# EAGLE design i2c_stm32 (EAGLE 9.4.0)

## Sheet 1 of 3: STM32F103C8 - Microcontroller
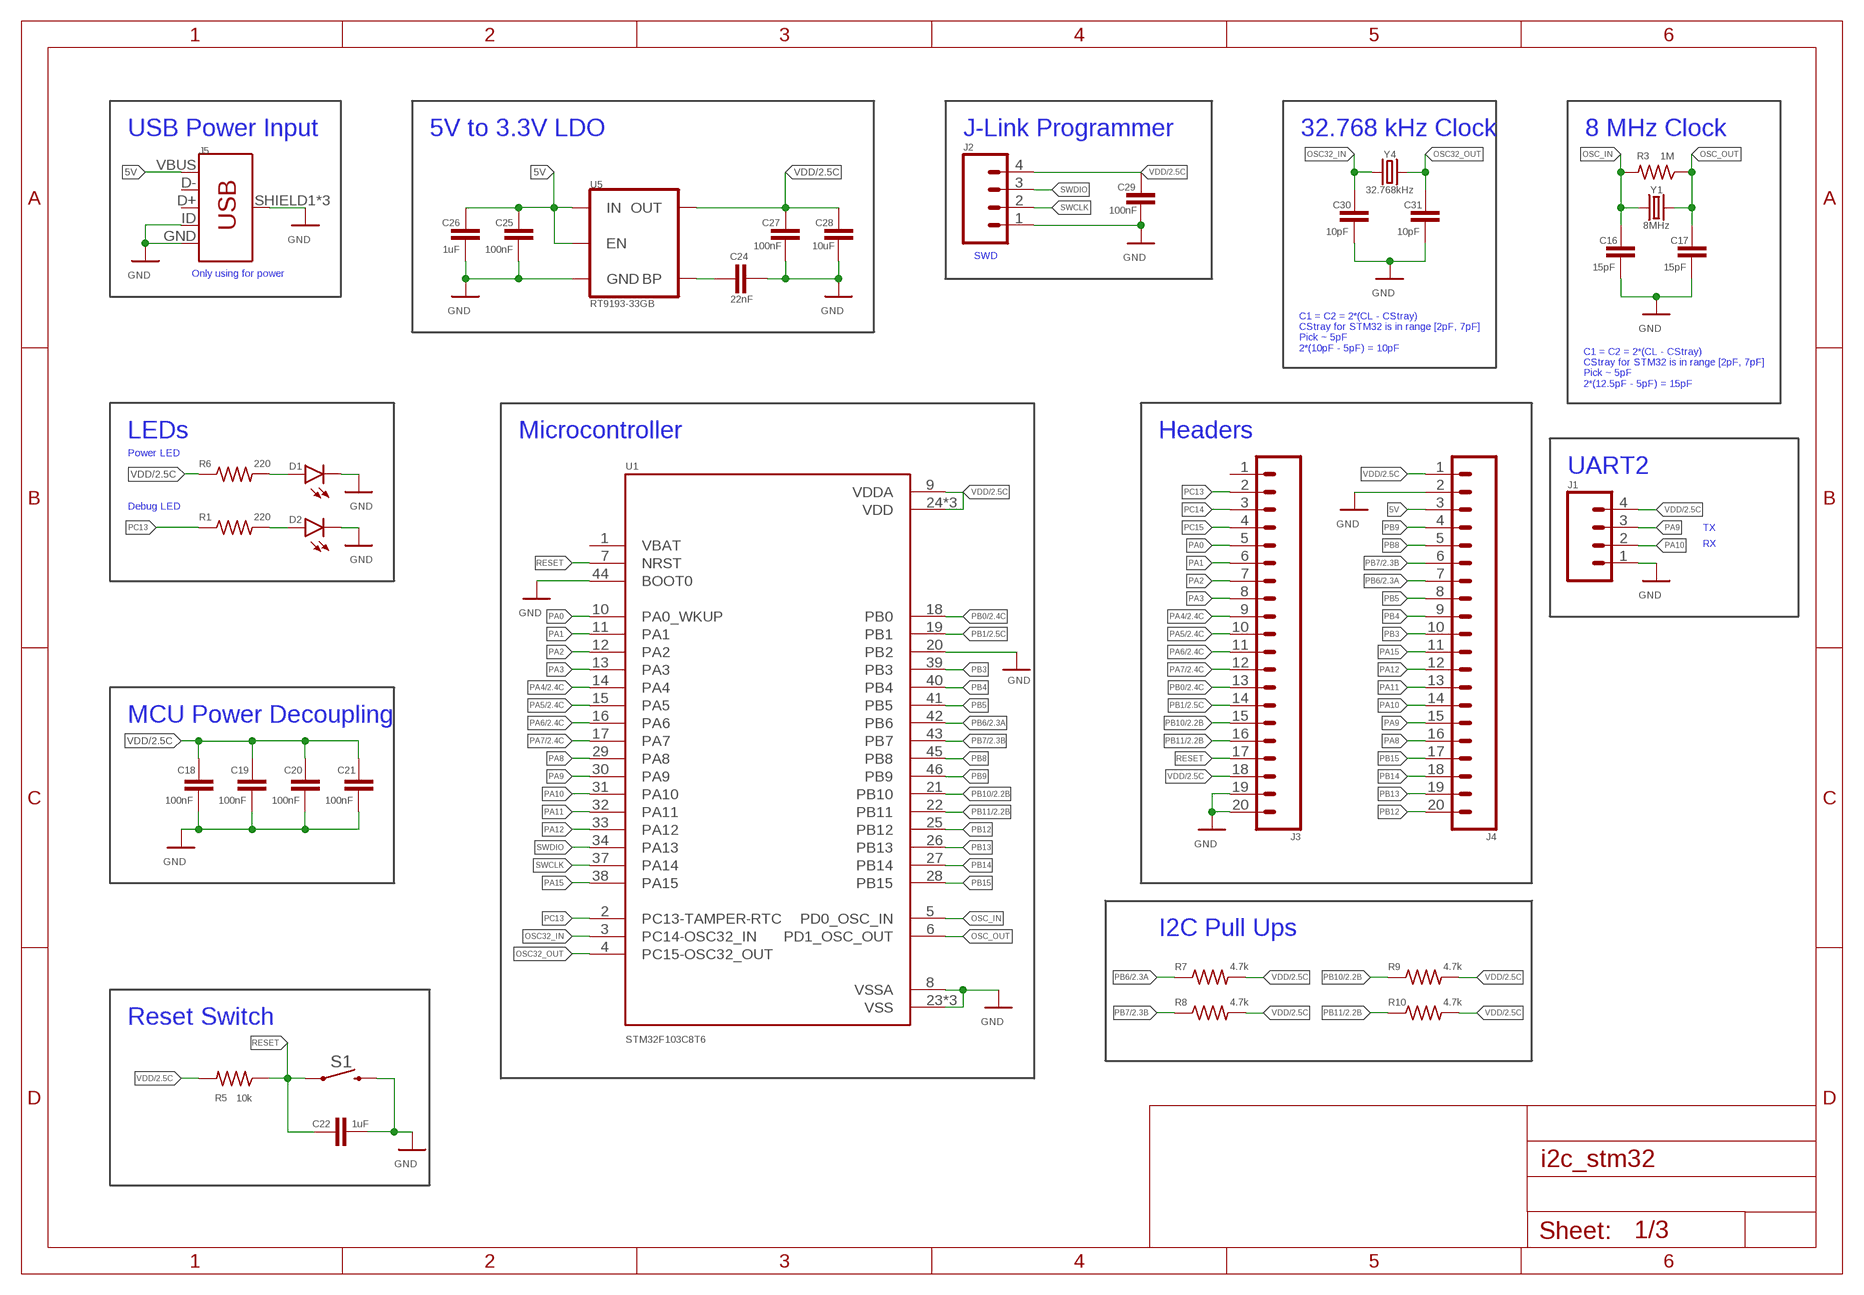
[diagram p0: schematic, sheet 1]

### Parts
C16  15pF  C0603C100C5GACTU  [CAP_0603]
C17  15pF  C0603C100C5GACTU  [CAP_0603]
C18  100nF  C0603C100C5GACTU  [CAP_0603]
C19  100nF  C0603C100C5GACTU  [CAP_0603]
C20  100nF  C0603C100C5GACTU  [CAP_0603]
C21  100nF  C0603C100C5GACTU  [CAP_0603]
C22  1uF  C0603C100C5GACTU  [CAP_0603]
C24  22nF  C0603C100C5GACTU  [CAP_0603]
C25  100nF  C0603C100C5GACTU  [CAP_0603]
C26  1uF  C0603C100C5GACTU  [CAP_0603]
C27  100nF  C0603C100C5GACTU  [CAP_0603]
C28  10uF  C0603C100C5GACTU  [CAP_0603]
C29  100nF  C0603C100C5GACTU  [CAP_0603]
C30  10pF  C0603C100C5GACTU  [CAP_0603]
C31  10pF  C0603C100C5GACTU  [CAP_0603]
D1  LED0603  [LED-0603]
D2  LED0603  [LED-0603]
J1  CONN_04  [1X04]
J2  CONN_04  [1X04]
J3  CONN_20  [1X20]
J4  CONN_20  [1X20]
J5  USB_MICRO-B_FEMALE-SMT  [USB-B-MICRO-SMD]
R1  220  RC0603JR-070RL  [RES_0603]
R3  1M  RC0603JR-070RL  [RES_0603]
R5  10k  RC0603JR-070RL  [RES_0603]
R6  220  RC0603JR-070RL  [RES_0603]
R7  4.7k  RC0603JR-070RL  [RES_0603]
R8  4.7k  RC0603JR-070RL  [RES_0603]
R9  4.7k  RC0603JR-070RL  [RES_0603]
R10  4.7k  RC0603JR-070RL  [RES_0603]
S1  MOMENTARY-SWITCH-SPST-PTH-6.0MM  [TACTILE_SWITCH_PTH_6.0MM]
U1  STM32F103C8T6  [QFP50P900X900X160-48N]
U5  RT9193-33GB  V_REG_MIC5205ADJ  [SOT23-5]
Y1  8MHz  CRYSTAL-8MHZSMD-5X3.2  [CRYSTAL-SMD-5X3.2-4PAD]
Y4  32.768kHz  CRYSTAL-32.768KHZSMD-3.2X1.5  [CRYSTAL-SMD-3.2X1.5MM]

### Nets
5V: C25.2 C26.2 J4.3 J5.VBUS U5.1(IN) U5.3(EN)
GND: C16.2 C17.2 C18.2 C19.2 C20.2 C21.2 C22.2 C24.1 C25.1 C26.1 C27.2 C28.2 C29.2 C30.2 C31.2 D1.C D2.C J1.1 J2.1 J3.19 J3.20 J4.2 J5.GND J5.ID J5.SHIELD1(SHIELD) J5.SHIELD2(SHIELD) J5.SHIELD3(SHIELD) S1.3 U1.8(VSSA) U1.20(PB2) U1.23(VSS) U1.35(VSS) U1.44(BOOT0) U1.47(VSS) U5.2(GND) ; also sheet 2
N$4: D1.A R6.2
N$5: C24.2 U5.4(BP)
N$6: D2.A R1.2
OSC32_IN: C30.1 U1.3(PC14-OSC32_IN) Y4.P$1
OSC32_OUT: C31.1 U1.4(PC15-OSC32_OUT) Y4.P$2
OSC_IN: C16.1 R3.2 U1.5(PD0_OSC_IN) Y1.1
OSC_OUT: C17.1 R3.1 U1.6(PD1_OSC_OUT) Y1.3
PA0: J3.5 U1.10(PA0_WKUP)
PA1: J3.6 U1.11(PA1)
PA2: J3.7 U1.12(PA2)
PA3: J3.8 U1.13(PA3)
PA4: J3.9 U1.14(PA4) ; also sheet 2
PA5: J3.10 U1.15(PA5) ; also sheet 2
PA6: J3.11 U1.16(PA6) ; also sheet 2
PA7: J3.12 U1.17(PA7) ; also sheet 2
PA8: J4.16 U1.29(PA8)
PA9: J1.3 J4.15 U1.30(PA9)
PA10: J1.2 J4.14 U1.31(PA10)
PA11: J4.13 U1.32(PA11)
PA12: J4.12 U1.33(PA12)
PA15: J4.11 U1.38(PA15)
PB0: J3.13 U1.18(PB0) ; also sheet 2
PB1: J3.14 U1.19(PB1) ; also sheet 2
PB3: J4.10 U1.39(PB3)
PB4: J4.9 U1.40(PB4)
PB5: J4.8 U1.41(PB5)
PB6: J4.7 R7.1 U1.42(PB6) ; also sheet 2
PB7: J4.6 R8.1 U1.43(PB7) ; also sheet 2
PB8: J4.5 U1.45(PB8)
PB9: J4.4 U1.46(PB9)
PB10: J3.15 R9.1 U1.21(PB10) ; also sheet 2
PB11: J3.16 R10.1 U1.22(PB11) ; also sheet 2
PB12: J4.20 U1.25(PB12)
PB13: J4.19 U1.26(PB13)
PB14: J4.18 U1.27(PB14)
PB15: J4.17 U1.28(PB15)
PC13: J3.2 R1.1 U1.2(PC13-TAMPER-RTC)
PC14: J3.3
PC15: J3.4
RESET: C22.1 J3.17 R5.1 S1.1 U1.7(NRST)
SWCLK: J2.2 U1.37(PA14)
SWDIO: J2.3 U1.34(PA13)
VDD: C18.1 C19.1 C20.1 C21.1 C27.1 C28.1 C29.1 J1.4 J2.4 J3.18 J4.1 R5.2 R6.1 R7.2 R8.2 R9.2 R10.2 U1.9(VDDA) U1.24(VDD) U1.36(VDD) U1.48(VDD) U5.5(OUT) ; also sheet 2
Unconnected: J3.1 J5.D+ J5.D- U1.1(VBAT)

### Notes on the sheet
- USB Power Input | 5V to 3.3V LDO | J-Link Programmer | 32.768 kHz Clock | 8 MHz Clock
- SWD
- Only using for power
- C1 = C2 = 2*(CL - CStray)
  CStray for STM32 is in range [2pF, 7pF]
  Pick ~ 5pF
  2*(10pF - 5pF) = 10pF
- C1 = C2 = 2*(CL - CStray)
  CStray for STM32 is in range [2pF, 7pF]
  Pick ~ 5pF
  2*(12.5pF - 5pF) = 15pF
- LEDs | Microcontroller | Headers
- Power LED
- UART2
- Debug LED
- TX
- RX
- MCU Power Decoupling
- I2C Pull Ups
- Reset Switch

## Sheet 2 of 3: BMP280 - Barometer
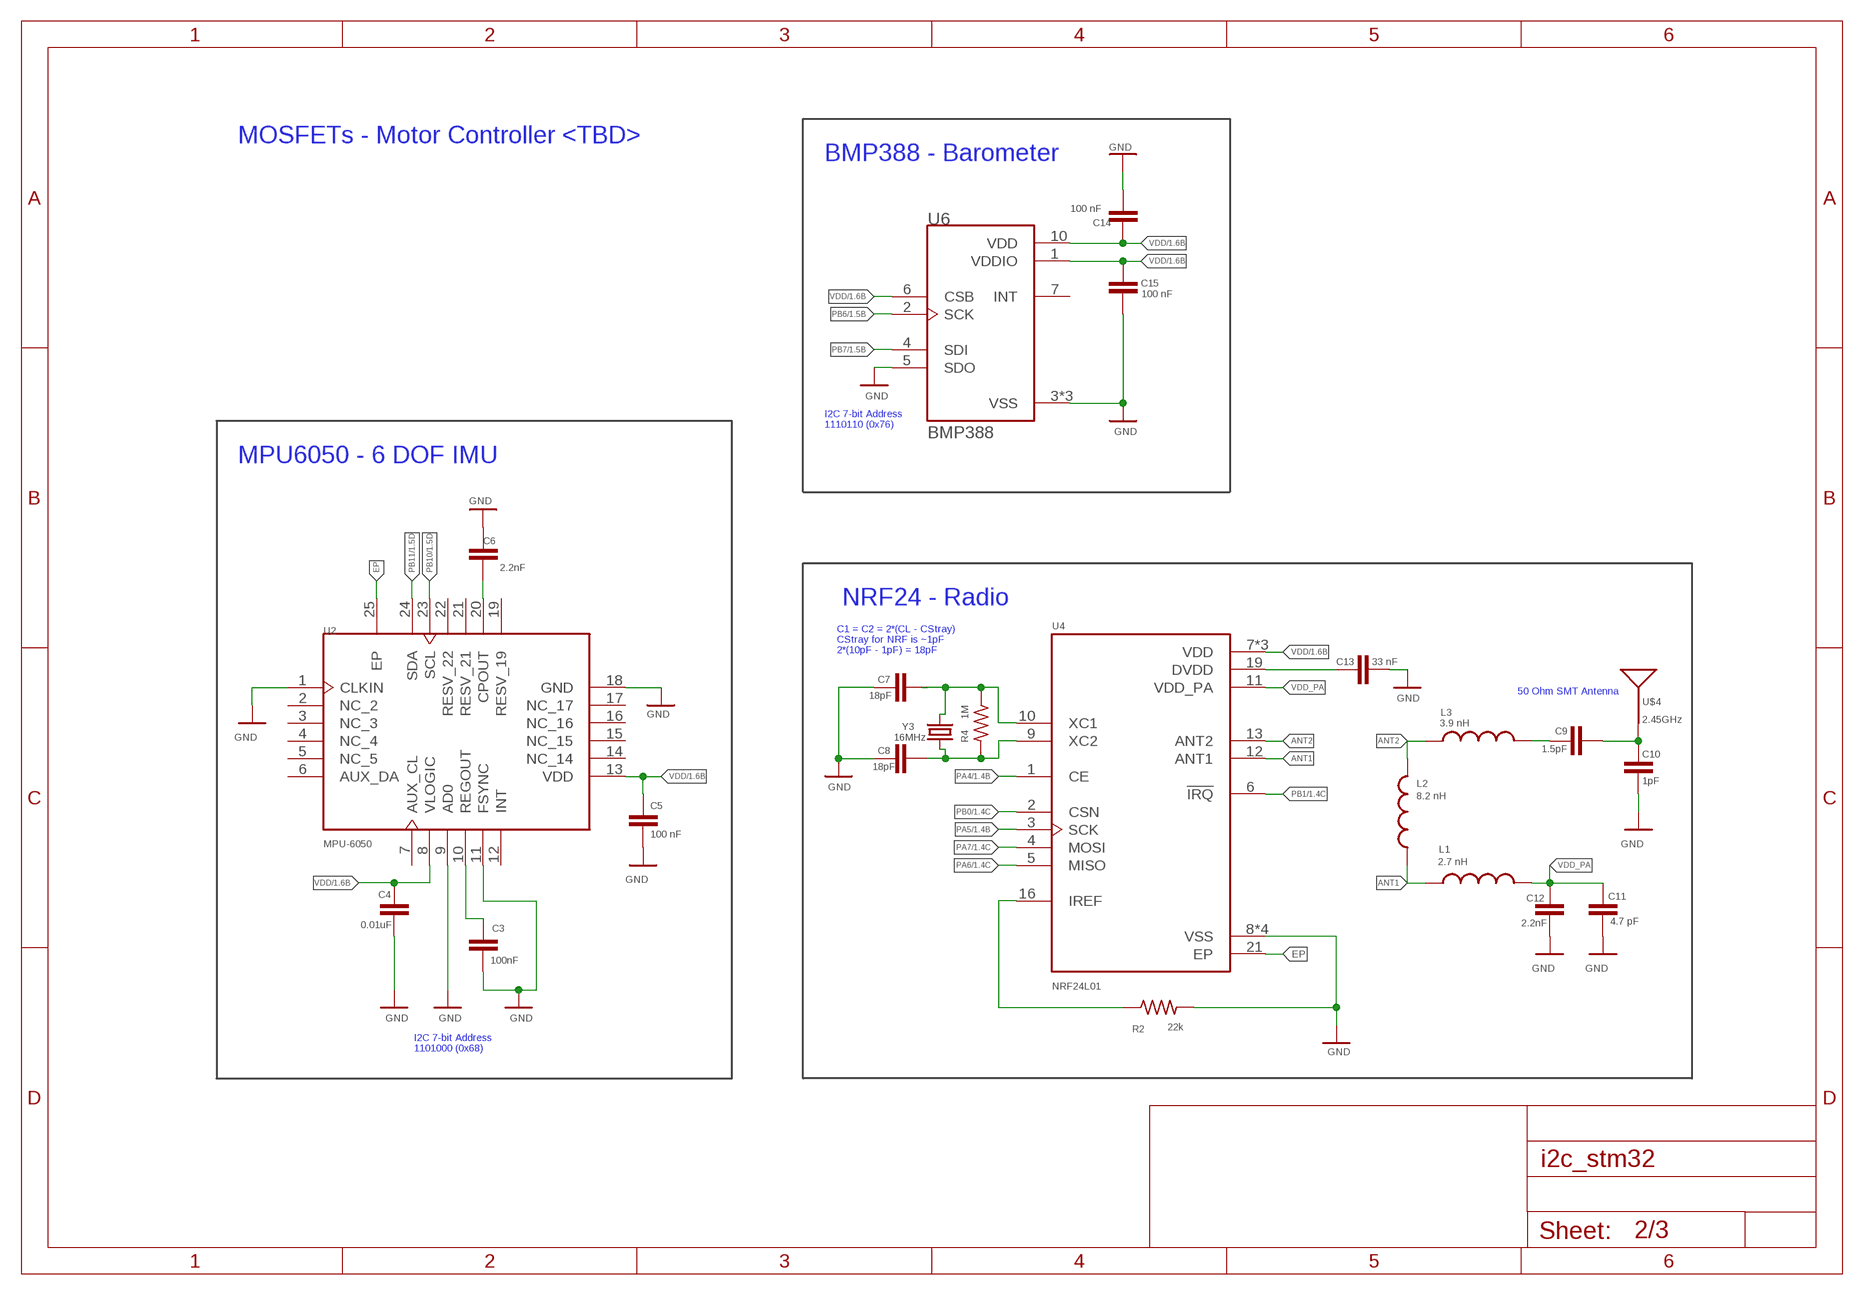
[diagram p1: schematic, sheet 2]

### Parts
C3  100nF  C0603C100C5GACTU  [CAP_0603]
C4  0.01uF  C0603C100C5GACTU  [CAP_0603]
C5  100 nF  C0603C100C5GACTU  [CAP_0603]
C6  2.2nF  C0603C100C5GACTU  [CAP_0603]
C7  18pF  C0603C100C5GACTU  [CAP_0603]
C8  18pF  C0603C100C5GACTU  [CAP_0603]
C9  1.5pF  C0603C100C5GACTU  [CAP_0603]
C10  1pF  C0603C100C5GACTU  [CAP_0603]
C11  4.7 pF  C0603C100C5GACTU  [CAP_0603]
C12  2.2nF  C0603C100C5GACTU  [CAP_0603]
C13  33 nF  C0603C100C5GACTU  [CAP_0603]
C14  100 nF  C0603C100C5GACTU  [CAP_0603]
C15  100 nF  C0603C100C5GACTU  [CAP_0603]
L1  2.7 nH  INDUCTOR_0603_M  [RESC0603_M]
L2  8.2 nH  INDUCTOR_0603_M  [RESC0603_M]
L3  3.9 nH  INDUCTOR_0603_M  [RESC0603_M]
R2  22k  RC0603JR-070RL  [RES_0603]
R4  1M  RC0603JR-070RL  [RES_0603]
U2  MPU-6050  [24-VFQFN]
U4  NRF24L01  [QFN50P400X400X95-21N]
U6  BMP388  [PQFN50P200X200X80-10N]
U$4  2.45GHz  ANTENNA2.4GHZ-6.5X2.2MM  [ANT-2.4GHZ-6.5X2.2MM]
Y3  16MHz  CRYSTAL-16MHZSMD-5X3.2  [CRYSTAL-SMD-5X3.2-4PAD]

### Nets
ANT1: L1.1 L2.1 U4.12(ANT1)
ANT2: L2.2 L3.1 U4.13(ANT2)
EP: U2.25(EP) U4.21(EP)
GND: C3.2 C4.2 C5.2 C6.2 C7.2 C8.2 C10.1 C11.1 C12.1 C13.2 C14.2 C15.1 R2.2 U2.1(CLKIN) U2.9(AD0) U2.11(FSYNC) U2.18(GND) U4.8(VSS) U4.14(VSS) U4.17(VSS) U4.20(VSS) U6.3(VSS) U6.5(SDO) U6.8(VSS) U6.9(VSS) ; also sheet 1
N$2: C3.1 U2.10(REGOUT)
N$3: C6.1 U2.20(CPOUT)
N$7: C8.1 R4.2 U4.9(XC2) Y3.1
N$8: C7.1 R4.1 U4.10(XC1) Y3.3
N$9: R2.1 U4.16(IREF)
N$12: C9.2 C10.2 U$4.FEED(SIGNAL)
N$13: C9.1 L3.2
N$17: C13.1 U4.19(DVDD)
PA4: U4.1(CE) ; also sheet 1
PA5: U4.3(SCK) ; also sheet 1
PA6: U4.5(MISO) ; also sheet 1
PA7: U4.4(MOSI) ; also sheet 1
PB0: U4.2(CSN) ; also sheet 1
PB1: U4.6(!IRQ) ; also sheet 1
PB6: U6.2(SCK) ; also sheet 1
PB7: U6.4(SDI) ; also sheet 1
PB10: U2.23(SCL) ; also sheet 1
PB11: U2.24(SDA) ; also sheet 1
VDD: C4.1 C5.1 C14.1 C15.2 U2.8(VLOGIC) U2.13(VDD) U4.7(VDD) U4.15(VDD) U4.18(VDD) U6.1(VDDIO) U6.6(CSB) U6.10(VDD) ; also sheet 1
VDD_PA: C11.2 C12.2 L1.2 U4.11(VDD_PA)
Unconnected: U2.2(NC_2) U2.3(NC_3) U2.4(NC_4) U2.5(NC_5) U2.6(AUX_DA) U2.7(AUX_CL) U2.12(INT) U2.14(NC_14) U2.15(NC_15) U2.16(NC_16) U2.17(NC_17) U2.19(RESV_19) U2.21(RESV_21) U2.22(RESV_22) U6.7(INT)

### Notes on the sheet
- MOSFETs - Motor Controller <TBD>
- BMP388 - Barometer
- I2C 7-bit Address
  1110110 (0x76)
- MPU6050 - 6 DOF IMU
- NRF24 - Radio
- C1 = C2 = 2*(CL - CStray)
  CStray for NRF is ~1pF
  2*(10pF - 1pF) = 18pF
- 50 Ohm SMT Antenna
- I2C 7-bit Address
  1101000 (0x68)

## Sheet 3 of 3
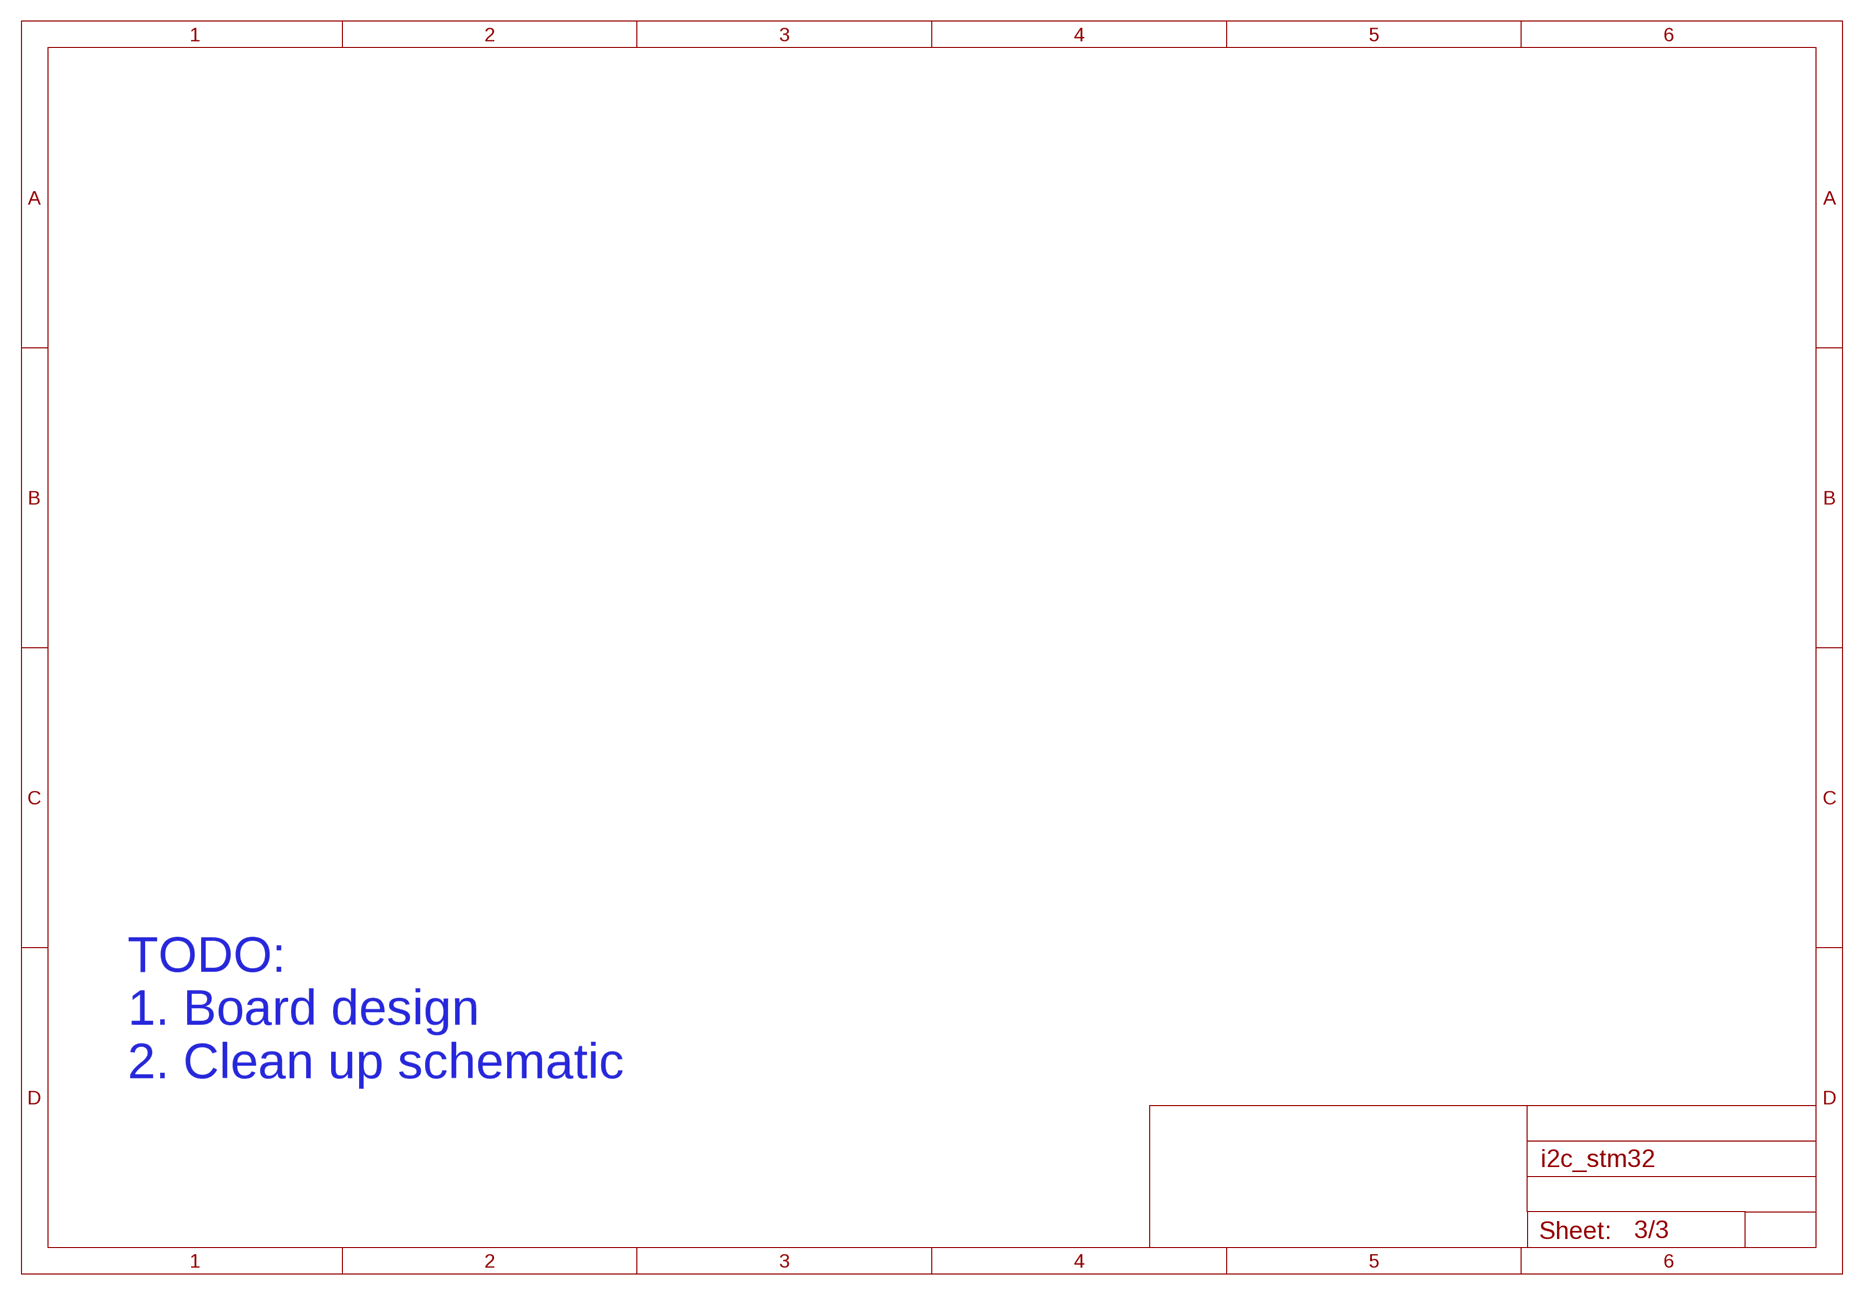
[diagram p2: schematic, sheet 3]

### Notes on the sheet
- TODO:
  1. Board design
  2. Clean up schematic

## Library data of the parts
C3-C22 C24-C31 = Resistor_Capacitor:C0603C100C5GACTU: CAP CER 10PF 50V C0G/NP0 0603 Manufacturer's datasheet <https://content.kemet.com/datasheets/KEM_C1003_C0G_SMD.pdf>; CREATED_BY: PCBLayout.com; DIGIKEY_PART_NUMBER: 399-7814-2-ND; MANUFACTURER: KEMET; MPN: C0603C100C5GACTU; PACKAGE: SMD 0603
D1 D2 = SparkFun-LED:LED: LED (Generic) Standard schematic elements and footprints for 5mm, 3mm, 1206, and 0603 sized LEDs. Generic LEDs with no color specified.
J1 J2 = SparkFun-Connectors:CONN_04: Multi connection point. Often used as Generic Header-pin footprint for 0.1 inch spaced/style header connections On any of the 0.1 inch spaced packages, you can populate with these: Break Away Headers - Straight <https://www.sparkfun.com/products/116> (PRT-00116) Break Away Male Headers - Right Angle <https://www.sparkfun.com/products/553> (PRT-00553) Female Headers <https://www.sparkfun.com/products/115> (PRT-00115) Break Away Headers - Machine Pin <https://www.sparkfun.com/products/117> (PRT-00117) Break Away Female Headers - Swiss Machine Pin <https://www.sparkfun.com/products/743> (PRT-00743) For SCREWTERMINALS and SPRING TERMINALS visit here: Screw Terimnals on SparkFun.com <https://www.sparkfun.com/search/results?term=Screw+Terminals> (5mm/3.5mm/2.54mm spacing) This device is also useful as a general connection point to wire up your design to another part of your project. Our various solder wires solder well into these plated through hole pads. Hook-Up Wire - Assortment (Stranded, 22 AWG) <https://www.sparkfun.com/products/11375> (PRT-11375) Hook-Up Wire - Assortment (Solid Core, 22 AWG) <https://www.sparkfun.com/products/11367> (PRT-11367) View the entire wire category on our website here <https://www.sparkfun.com/categories/141> Special notes: Molex polarized connector foot print use with SKU : PRT-08231 with associated crimp pins and housings. 1MM SMD Version SKU: PRT-10208; PROD_ID: CONN-09696
J3 J4 = SparkFun-Connectors:CONN_20: Multi connection point. Often used as Generic Header-pin footprint for 0.1 inch spaced/style header connections On any of the 0.1 inch spaced packages, you can populate with these: Break Away Headers - Straight <https://www.sparkfun.com/products/116> (PRT-00116) Break Away Male Headers - Right Angle <https://www.sparkfun.com/products/553> (PRT-00553) Female Headers <https://www.sparkfun.com/products/115> (PRT-00115) Break Away Headers - Machine Pin <https://www.sparkfun.com/products/117> (PRT-00117) Break Away Female Headers - Swiss Machine Pin <https://www.sparkfun.com/products/743> (PRT-00743) For SCREWTERMINALS and SPRING TERMINALS visit here: Screw Terimnals on SparkFun.com <https://www.sparkfun.com/search/results?term=Screw+Terminals> (5mm/3.5mm/2.54mm spacing) This device is also useful as a general connection point to wire up your design to another part of your project. Our various solder wires solder well into these plated through hole pads. Hook-Up Wire - Assortment (Stranded, 22 AWG) <https://www.sparkfun.com/products/11375> (PRT-11375) Hook-Up Wire - Assortment (Solid Core, 22 AWG) <https://www.sparkfun.com/products/11367> (PRT-11367) View the entire wire category on our website here <https://www.sparkfun.com/categories/141> Special notes: Molex polarized connector foot print use with SKU : PRT-08231 with associated crimp pins and housings. 1MM SMD Version SKU: PRT-10208 NOTES ON THE VARIANTS LOCK and LOCK_LONGPADS... This footprint was designed to help hold the alignment of a through-hole component (i.e. 6-pin header) while soldering it into place. You may notice that each hole has been shifted either up or down by 0.005 of an inch from it's more standard position (which is a perfectly straight line). This slight alteration caused the pins (the squares in the middle) to touch the edges of the holes. Because they are alternating, it causes a "brace" to hold the component in place. 0.005 has proven to be the perfect amount of "off-center" position when using our standard breakaway headers. Although looks a little odd when you look at the bare footprint, once you have a header in there, the alteration is very hard to notice. Also,if you push a header all the way into place, it is covered up entirely on the bottom side. Note about LOCK SPECIAL package: This is just like the LOCK variant in that the holes are staggared by 5 mil, but except for the last two holes. They are not altered from the "standard" footprint layout. This is used for a special purpose on the layout of our Graphic LCD Backpack. Make sure you want to use this device before selecting it for you project!
J5 = SparkFun-Connectors:USB_MICRO-B: USB Type Micro-B Connector Male/female and PTH/SMT variants SparkFun Products: SparkFun microB USB Breakout <https://www.sparkfun.com/products/12035> SparkFun USB microB Plug Breakout <https://www.sparkfun.com/products/10031> SparkFun ESP8266 Thing <https://www.sparkfun.com/products/13231>; PROD_ID: CONN-11752
L1-L3 = Nordic_nRF:INDUCTOR: Generic chip inductor
R1-R10 = Resistor_Capacitor:RC0603JR-070RL: RES SMD 0 OHM JUMPER 1/10W 0603 Manufacturer's datasheet <http://www.yageo.com/documents/recent/PYu-RC_Group_51_RoHS_L_10.pdf>; CREATED_BY: PCBLayout.com; DIGIKEY_PART_NUMBER: 311-0.0GRTR-ND; MANUFACTURER: Yageo; MPN: RC0603JR-070RL; PACKAGE: SMD 0603
S1 = SparkFun-Switches:MOMENTARY-SWITCH-SPST: Momentary Switch (Pushbutton) - SPST Normally-open (NO) SPST momentary switches (buttons, pushbuttons). Variants PTH-12MM - 12mm square, through-hole Momentary Pushbutton Switch - 12mm Square <https://www.sparkfun.com/products/9190> (COM-09190) PTH-6.0MM, PTH-6.0MM-KIT - 6.0mm square, through-hole Mini Pushbutton Switch <https://www.sparkfun.com/products/97> (COM-00097) KIT package intended for soldering kit's - only one side of pads' copper is exposed. PTH-RIGHT-ANGLE-KIT - Right-angle, through-hole Right Angle Tactile Button <https://www.sparkfun.com/products/10791> - Used on SparkFun BigTime Watch Kit <https://www.sparkfun.com/products/11734> SMD-12MM - 12mm square, surface-mount Tactile Button - SMD (12mm) <https://www.sparkfun.com/products/12993> (COM-12993) Used on SparkFun PicoBoard <https://www.sparkfun.com/products/11888> SMD-4.5MM - 4.5mm Square Trackball Switch Used on SparkFun Blackberry Trackballer Breakout <https://www.sparkfun.com/products/13169> SMD-4.6MMX2.8MM - 4.60mm x 2.80mm, surface mount Used on SparkFun SAMD21 Mini Breakout <https://www.sparkfun.com/products/13664> SMD-5.2MM, SMD-5.2-REDUNDANT - 5.2mm square, surface-mount Mini Pushbutton Switch - SMD <https://www.sparkfun.com/products/8720> (COM-08720) Used on Arduino Pro Mini <https://www.sparkfun.com/products/11114> REDUNDANT package connects both switch circuits together SMD-6.0X3.5MM - 6.0 x 3.5mm, surface mount Momentary Reset Switch SMD <https://www.sparkfun.com/products/8229> (COM-08229) SMD-6.2MM-TALL - 6.2mm square, surface mount Tactile Button - SMD (6mm) <https://www.sparkfun.com/products/12992> Used on SparkFun Digital Sandbox <https://www.sparkfun.com/products/12651> SMD-RIGHT-ANGLE - Right-angle, surface mount Used on SparkFun Block for Intel® Edison - Arduino <https://www.sparkfun.com/products/13036>; PROD_ID: SWCH-08441; SF_SKU: COM-00097
U1 = STM32F103C8T6:STM32F103C8T6: Mainstream Performance line, ARM Cortex-M3 MCU with 64 Kbytes Flash, 72 MHz CPU, motor control, USB and CAN Check prices <https://pricing.snapeda.com/parts/STM32F103C8T6/STMicroelectronics/view-part?ref=eda>; AVAILABILITY: Warning; DESCRIPTION: ARM® Cortex®-M3 STM32F1 Microcontroller IC 32-Bit 72MHz 64KB (64K x 8) FLASH 48-LQFP (7x7); MF: STMicroelectronics; MP: STM32F103C8T6; PACKAGE: LQFP-48 STMicroelectronics; PRICE: None; PURCHASE-URL: https://pricing.snapeda.com/search/part/STM32F103C8T6/?ref=eda; SPICEPREFIX: X
U2 = Sensor:MPU-6050: IMU ACCEL/GYRO 3-AXIS I2C 24QFN Manufacturer's datasheet <https://store.invensense.com/datasheets/invensense/MPU-6050_DataSheet_V3%204.pdf>; CREATED_BY: PCBLayout.com; DIGIKEY_PART_NUMBER: 1428-1007-1-ND; MANUFACTURER: TDK InvenSense; MPN: MPU-6050; PACKAGE: 24-VFQFN
U4 = NRF24L01:NRF24L01: The nRF24L01 is a single chip 2.4GHz transceiver with an embedded baseband protocol engine (Enhanced ShockBurst™), designed for ultra low power wireless applications. The nRF24L01 is designed for operation in the world wide ISM frequency band at 2.400 - 2.4835GHz. An MCU (microcontroller) and very few external passive components are needed to design a radio system with the nRF24L01. The nRF24L01 is configured and operated through a Serial Peripheral Interface (SPI.) Through this interface the register map is available. The register map contains all configuration registers in the nRF24L01 and is accessible in all operation modes of the chip. Check prices <https://pricing.snapeda.com/parts/NRF24L01/Nordic/view-part?ref=eda>; AVAILABILITY: Warning; DESCRIPTION: IC RF TxRx Only General ISM > 1GHZ 2.4GHz 20-VFQFN Exposed Pad; MF: Nordic; MP: NRF24L01; PACKAGE: VFQFN-20 Nordic Semiconductor; PRICE: None; PURCHASE-URL: https://pricing.snapeda.com/search/part/NRF24L01/?ref=eda
U5 = SparkFun-IC-Power:V_REG_MIC5205: V_REG MIC5205 Standard 3.3V, 5V, and Adjustable 150mA LDO voltage regulator in SOT-23 layout. Micrel part MIC5205. BP (by-pass) pin is used to lower output noise with 470pF cap, may be left open. On the adjustable version BP is used to set output.; PROD_ID: VREG-12594; VALUE: ADJ
U6 = BMP388:BMP388: P-Sensor SPI I2C 1, 25 Bar SMD; DESCRIPTION: Pressure Sensor 4.35PSI ~ 18.13PSI (30kPa ~ 125kPa) Absolute 10-WFLGA; DIGI-KEY_PART_NUMBER: 828-1079-1-ND; MF: Bosch Sensortec; MP: BMP388; PACKAGE: WFLGA-10 Bosch Tools; PURCHASE-URL: https://pricing.snapeda.com/search/part/BMP388/?ref=eda
U$4 = SparkFun-RF:ANTENNA: Single-ended Antennae 2.4GHz and antennae with just one terminal. These are all chip antennae. 2.4GHz (WiFi/BT/ZigBee) Antennae ANT-2.4GHZ-6.5X2.2MM - 6.5 x 2.2 mm chip antenna. (SparkFun Product <https://www.sparkfun.com/products/144>) ANT-2.4GHZ8.0X1.0MM - 8.0 x 1.0 mm chip antenna. (Datasheet <http://www.mouser.com/ds/2/611/antenna_2500at44m0400-242425.pdf>) ANT-2.4GHZ9.5X2.0MM - 9.5 x 2.0 mm chip antenna. (SparkFun Product <https://www.sparkfun.com/products/9025>); PROD_ID: ANT-08187; SF_ID: WRL-00144
Y1 = SparkFun-Clocks:CRYSTAL-8MHZ: 8MHz Crystal Datasheet Example <http://www.futureelectronics.com/en/technologies/electromechanical/timing-devices/crystals/Pages/6008189-ABM3B-8.000MHZ-B2-T.aspx?IM=0> Frequency: 8MHz Frequency Tolerance: ±20ppm Load Capacitance: 18pF SparkFun Products: Pro Micro -3.3V/8MHz <https://www.sparkfun.com/products/12587> WAV Trigger <https://www.sparkfun.com/products/13660>; PROD_ID: XTAL-09431
Y3 = SparkFun-Clocks:CRYSTAL-16MHZ: 16MHz Crystal Digikey Example <http://www.digikey.com/product-search/en?keywords=535-9122-1-ND> Frequency: 16MHz Frequency Stability: ±50ppm Frequency Tolerance: ±20ppm Load Capacitance: 18pF SparkFun Products: Pro Micro -5V/16MHz <https://www.sparkfun.com/products/12640> SparkFun Serial Enabled LCD Kit <https://www.sparkfun.com/products/10097>; PROD_ID: XTAL-08218; SF_ID: COM-00094
Y4 = SparkFun-Clocks:CRYSTAL-32.768KHZ: 32.768kHz Crystal Frequency: 32.768kHz Frequency Stability: ±20ppm Load Capacitance: 12.5pF (PTH-2X6 & SMD-3.2X1.5), 6pF (SMD-2X6) SparkFun Products: SparkFun BigTime Watch Kit <https://www.sparkfun.com/products/11734> SparkFun nRF52832 Breakout <https://www.sparkfun.com/products/13990> SparkFun Real Time Clock Module <https://www.sparkfun.com/products/12708>; PROD_ID: XTAL-13062

## Board
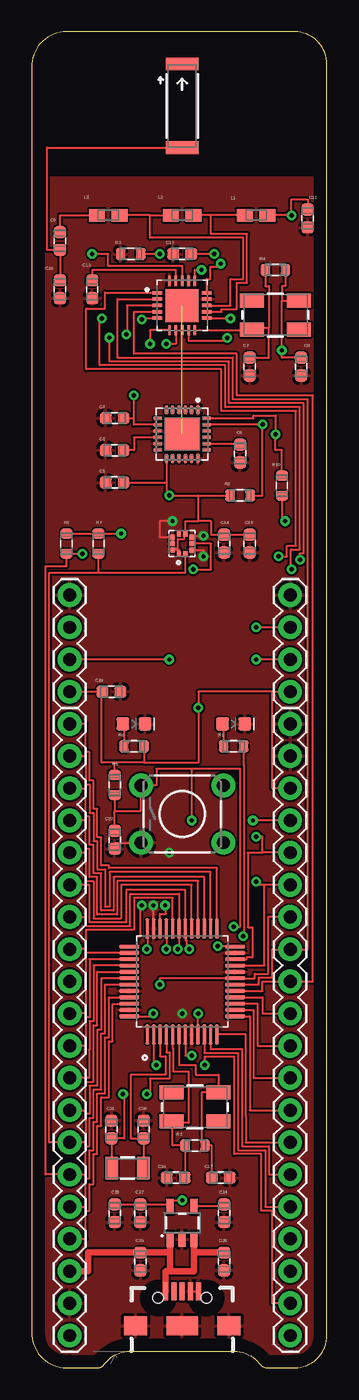
[diagram p3: board, top side]
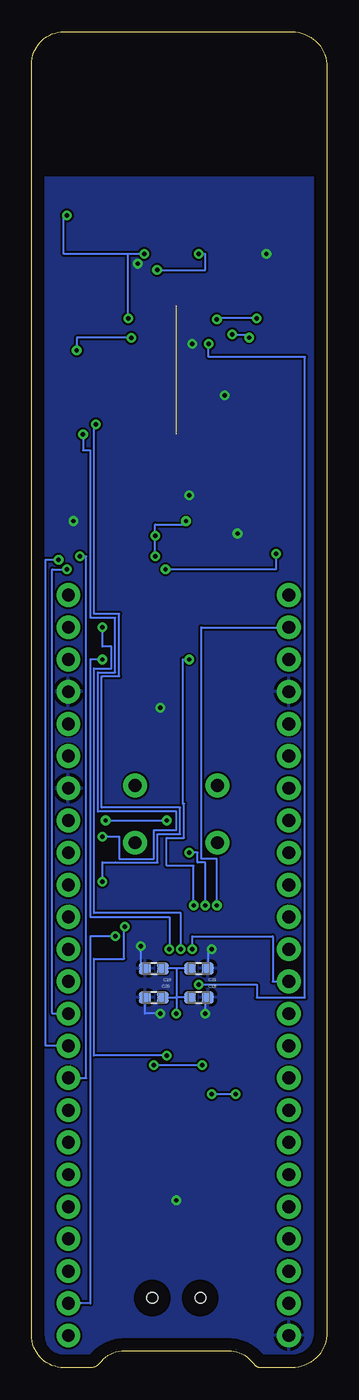
[diagram p4: board, bottom side, seen from below]

Size 23.32 x 105.43 mm. Coordinates in mm from the lower left corner, seen from the top.
Outline: 18.63,0.01 20.78,0.01 arc90 23.32,2.55 23.32,102.88 arc90 20.78,105.42 3,105.42 arc90 0,102.88 0,2.55 arc90 3,0.01 5.26,0.01 arc55 5.7,0.24 arc-55 7.77,1.31 15.99,1.31 arc-52 18,0.32 arc52 18.63,0.01
Copper layers (1*16): Top 0.035mm / dielectric 1.5mm / Bottom 0.035mm
Design rules "default": minimum track width 6mil, minimum drill 0.35mm, track to track 6mil, track to pad 6mil, pad to pad 6mil, via to via 6mil, smd to smd 6mil, copper to edge 40mil, drill to drill 6mil, minimum pad ring 10mil, minimum via ring 8mil, stop-mask expansion 4mil, vias tented up to drill 0mil, thermal gap 10mil

### Footprints (pad centres in the part's own frame; a part is rotated, then mirrored left to right if it is on the bottom)
CAP_0603 = smd 0.92 x 0.93: 1 -0.705,0; 2 0.705,0
LED-0603 = smd 1 x 1: A -0.877,0; C 0.877,0
1X04 = drill 1.016 pad 1.88: 1 0,0; 2 2.54,0; 3 5.08,0; 4 7.62,0
1X20 = drill 1.016 pad 1.88: 1 0,0; 2 2.54,0; 3 5.08,0; 4 7.62,0; 5 10.16,0; 6 12.7,0; 7 15.24,0; 8 17.78,0; 9 20.32,0; 10 22.86,0; 11 25.4,0; 12 27.94,0; 13 30.48,0; 14 33.02,0; 15 35.56,0; 16 38.1,0; 17 40.64,0; 18 43.18,0; 19 45.72,0; 20 48.26,0
USB-B-MICRO-SMD = smd 1.45 x 0.4: D+ 2.725,0; D- 2.725,0.65; GND 2.725,-1.3; ID 2.725,-0.65; VBUS 2.725,1.3 | smd 1.5 x 1.8: SHIELD1 0,3.685; SHIELD2 0,-3.685 | smd 1.5 x 2.5: SHIELD3 0,0 | hole 0.85: 2.2,1.9; 2.2,-1.9
RESC0603_M = smd 1.25 x 1: 1 -0.9,0; 2 0.9,0
RES_0603 = smd 0.74 x 0.93: 1 -0.795,0; 2 0.795,0
TACTILE_SWITCH_PTH_6.0MM = drill 1.016 pad 1.88: 1 -3.251,2.261; 2 3.251,2.261; 3 -3.251,-2.261; 4 3.251,-2.261
QFP50P900X900X160-48N = smd 1.56 x 0.28: 1 -4.18,2.75; 2 -4.18,2.25; 3 -4.18,1.75; 4 -4.18,1.25; 5 -4.18,0.75; 6 -4.18,0.25; 7 -4.18,-0.25; 8 -4.18,-0.75; 9 -4.18,-1.25; 10 -4.18,-1.75; 11 -4.18,-2.25; 12 -4.18,-2.75; 25 4.18,-2.75; 26 4.18,-2.25; 27 4.18,-1.75; 28 4.18,-1.25; 29 4.18,-0.75; 30 4.18,-0.25; 31 4.18,0.25; 32 4.18,0.75; 33 4.18,1.25; 34 4.18,1.75; 35 4.18,2.25; 36 4.18,2.75 | smd 0.28 x 1.56: 13 -2.75,-4.18; 14 -2.25,-4.18; 15 -1.75,-4.18; 16 -1.25,-4.18; 17 -0.75,-4.18; 18 -0.25,-4.18; 19 0.25,-4.18; 20 0.75,-4.18; 21 1.25,-4.18; 22 1.75,-4.18; 23 2.25,-4.18; 24 2.75,-4.18; 37 2.75,4.18; 38 2.25,4.18; 39 1.75,4.18; 40 1.25,4.18; 41 0.75,4.18; 42 0.25,4.18; 43 -0.25,4.18; 44 -0.75,4.18; 45 -1.25,4.18; 46 -1.75,4.18; 47 -2.25,4.18; 48 -2.75,4.18
24-VFQFN = smd 0.26 x 0.69: 1 -1.25,-1.92; 2 -0.75,-1.92; 3 -0.25,-1.92; 4 0.25,-1.92; 5 0.75,-1.92; 6 1.25,-1.92; 13 1.25,1.92; 14 0.75,1.92; 15 0.25,1.92; 16 -0.25,1.92; 17 -0.75,1.92; 18 -1.25,1.92 | smd 0.69 x 0.26: 7 1.92,-1.25; 8 1.92,-0.75; 9 1.92,-0.25; 10 1.92,0.25; 11 1.92,0.75; 12 1.92,1.25; 19 -1.92,1.25; 20 -1.92,0.75; 21 -1.92,0.25; 22 -1.92,-0.25; 23 -1.92,-0.75; 24 -1.92,-1.25 | smd 2.7 x 2.6: 25 0,0
QFN50P400X400X95-21N = smd 0.81 x 0.26: 1 -1.95,1; 2 -1.95,0.5; 3 -1.95,0; 4 -1.95,-0.5; 5 -1.95,-1; 11 1.95,-1; 12 1.95,-0.5; 13 1.95,0; 14 1.95,0.5; 15 1.95,1 | smd 0.26 x 0.81: 6 -1,-1.95; 7 -0.5,-1.95; 8 0,-1.95; 9 0.5,-1.95; 10 1,-1.95; 16 1,1.95; 17 0.5,1.95; 18 0,1.95; 19 -0.5,1.95; 20 -1,1.95 | smd 2.6 x 2.6: 21 0,0
SOT23-5 = smd 0.55 x 1.2: 1 -0.95,-1.3; 2 0,-1.3; 3 0.95,-1.3; 4 0.95,1.3; 5 -0.95,1.3
PQFN50P200X200X80-10N = smd 0.35 x 0.38: 1 -0.765,0.25; 2 -0.765,-0.25; 3 -0.5,-0.765; 4 0,-0.765; 5 0.5,-0.765; 6 0.765,-0.25; 7 0.765,0.25; 8 0.5,0.765; 9 0,0.765; 10 -0.5,0.765
ANT-2.4GHZ-6.5X2.2MM = smd 1.016 x 2.54: FEED -3.302,0; NC 3.302,0
CRYSTAL-SMD-5X3.2-4PAD = smd 1.9 x 1.1: 1 -1.85,-1.15; 2 1.85,-1.15; 3 1.85,1.15; 4 -1.85,1.15
CRYSTAL-SMD-3.2X1.5MM = smd 1 x 1.8: P$1 -1.25,0; P$2 1.25,0

### Placement (x,y rotation side)
C3  6.56,72.4 180 top
C4  6.56,74.94 180 top
C5  6.56,69.86 180 top
C6  16.46,72.15 270 top
C7  17.22,79 270 top
C8  21.29,79 270 top
C9  2.24,88.91 270 top
C10  2.24,85.1 90 top
C11  21.8,90.69 90 top
C12  11.89,87.89 0 top
C13  4.78,85.1 270 top
C14  15.19,65.03 270 top
C15  17.22,65.03 90 top
C16  11.38,15 180 top
C17  14.94,15 0 top
C18  10.11,29.22 180 bottom
C19  13.67,31.51 0 bottom
C20  13.67,29.22 0 bottom
C21  10.11,31.51 180 bottom
C22  6.56,41.67 270 top
C24  15.19,12.2 90 top
C25  8.59,8.39 90 top
C26  15.19,8.39 90 top
C27  8.59,12.2 270 top
C28  6.56,12.2 270 top
C29  6.3,53.35 0 top
C30  8.84,18.81 90 top
C31  6.3,18.81 90 top
D1  8.08,50.81 0 top
D2  15.95,50.81 0 top
J1  20.42,60.97 270 top
J2  3,60.97 270 top
J3  20.42,2.55 90 top
J4  3,2.55 90 top
J5  11.89,3.31 90 top
L1  17.73,90.94 0 top
L2  11.89,90.94 180 top
L3  6.05,90.94 180 top
R1  15.95,49.03 180 top
R2  7.83,87.89 180 top
R3  12.91,17.54 180 top
R4  19.26,86.62 0 top
R5  6.56,45.98 90 top
R6  8.08,49.03 180 top
R7  5.29,65.03 90 top
R8  2.75,65.03 90 top
R9  16.46,68.84 180 top
R10  19.76,69.61 270 top
S1  11.89,43.7 0 top
U1  11.89,30.49 90 top
U2  11.89,73.67 180 top
U4  11.89,83.83 0 top
U5  11.89,11.44 0 top
U6  11.89,65.03 90 top
U$4  11.89,99.58 90 top
Y1  12.91,20.58 0 top
Y3  19.26,83.07 180 top
Y4  7.57,15.76 180 top

### Tracks (layer width: path | path; a pad name or v marks a point on that pad's centre or on a via)
5V
  Top 0.508: 10.94,7.63 U5.1 10.94,9.1 C25.2 4.45,9.1 4.45,7.63 J4.3 | J5.VBUS 10.59,7.63 10.94,7.63 | U5.3 12.84,9.1 | 12.84,9.1 12.84,7.63 10.94,7.63 | C26.2 12.84,9.1
ANT1
  Top 0.152: 14.18,90.94 14.18,89.47 17.02,89.47 17.02,85.61 16.21,85.61 16.21,83.52 14.99,83.52 14.99,83.33 U4.12 | 14.18,90.94 L2.1 | L1.1 14.18,90.94
ANT2
  Top 0.152: 9.35,90.94 L2.2 | 9.35,90.94 9.35,89.16 16.72,89.16 16.72,85.91 15.7,85.91 15.7,83.83 U4.13 | 9.35,90.94 L3.1
EP  (1 unrouted)
GND  (via drill 0.35)
  Top 0.152: v9.61,36.49 9.64,36.49 U1.35 | 10.62,40.65 v10.87,40.65 8.64,40.65 8.64,41.41 | 8.64,41.41 S1.3 | C22.2 6.56,41.41 8.64,41.41 | U6.3 13.57,64.53 v13.57,64.02 | v13.57,65.64 12.66,65.64 U6.5 | v11.13,66.81 10.11,66.81 10.11,65.53 U6.8 | J5.ID J5.GND
  Bottom 0.152: C21.2 11.89,31.51 | 11.89,31.51 C19.2 | C18.2 11.89,29.22 | 11.89,31.51 11.89,29.22 | C20.2 11.89,29.22 | 11.89,29.22 v11.89,27.95 | v9.61,36.49 9.61,39.86 | 9.61,39.86 9.6,39.86 | 9.61,39.86 10.21,39.86 10.21,40.65 v10.87,40.65 | v13.57,64.02 13.57,65.54 13.67,65.54 13.67,65.64 v13.57,65.64 13.57,66.56 11.13,66.56 v11.13,66.81
  pour Top: -2.26,93.99 28.4,93.99 28.4,0.01 -2.26,0.01
N$2
  Top 0.152: C3.1 8.08,72.4 8.08,73.42 U2.10
N$3
  Top 0.152: U2.20 16.46,72.92 C6.1
N$4
  Top 0.152: D1.A 7.29,50.81 R6.2
N$5
  Top 0.152: C24.2 15.19,12.74 U5.4
N$6
  Top 0.152: D2.A 15.16,50.81 R1.2
N$7  (via drill 0.35)
  Top 0.152: C8.1 19.76,79.71 v19.76,80.27 19.76,84.22 | 19.76,84.22 Y3.1 | R4.2 20.05,85.35 19.76,85.35 19.76,84.22 | U4.9 12.39,81.04 15.45,81.04 v15.45,81.27
  Bottom 0.152: v15.45,81.27 19.76,81.27 v19.76,80.27
N$8
  Top 0.152: C7.1 18.75,79.71 18.75,82.05 | 18.75,82.05 17.41,82.05 Y3.3 17.41,81.88 U4.10 | R4.1 18.46,85.35 18.75,85.35 18.75,82.05
N$9  (via drill 0.35)
  Top 0.152: v13.41,86.62 12.91,86.62 12.89,86.62 U4.16 | v10.11,87.89 R2.1
  Bottom 0.152: v13.41,86.62 9.6,86.62 9.6,87.89 v10.11,87.89
N$12
  Top 0.152: C10.2 C9.2 1.22,88.2 1.22,96.28 U$4.FEED
N$13
  Top 0.152: C9.1 2.24,90.94 L3.2
N$17
  Top 0.152: U4.19 11.39,86.62 4.78,86.62 C13.1
OSC32_IN
  Top 0.152: U1.3 10.14,24.59 10.57,24.59 10.57,23.12 7.83,23.12 7.83,18.1 C30.1 8.84,15.76 Y4.P$1
OSC32_OUT  (via drill 0.35)
  Top 0.152: U1.4 10.64,24.9 10.87,24.9 10.87,22.82 9.35,22.82 9.35,21.6 v9.1,21.6 | Y4.P$2 6.3,15.76 C31.1 7.32,18.1 7.32,21.6 v7.22,21.6
  Bottom 0.152: v9.1,21.6 v7.22,21.6
OSC_IN
  Top 0.152: U1.5 11.14,25.2 11.18,25.2 11.18,23.38 12.4,23.38 12.4,19.31 11.13,19.31 | 11.13,19.31 11.06,19.31 Y1.1 | 11.13,19.31 11.13,17.54 R3.2 12.11,15 C16.1
OSC_OUT
  Top 0.152: U1.6 11.64,23.89 12.96,23.89 12.96,23.12 14.76,23.12 Y1.3 13.41,21.73 13.41,17.54 R3.1 14.23,17.54 C17.1
PA0
  Top 0.152: J3.5 18.44,12.71 18.44,17.18 16.31,17.18 16.31,24.85 13.64,24.85 U1.10
PA1
  Top 0.152: U1.11 14.14,25.16 16.61,25.16 16.61,17.48 18.75,17.48 18.75,15.25 J3.6
PA2
  Top 0.152: U1.12 16.92,26.31 16.92,20.33 16.92,19.82 16.92,17.79 J3.7
PA3
  Top 0.152: U1.13 17.22,27.74 17.22,20.33 J3.8
PA4  (via drill 0.35)
  Top 0.152: J3.9 17.53,22.87 17.53,28.24 U1.14 | v19.51,64.02 20.18,64.02 20.18,64.88 20.88,64.88 20.88,75.5 14.99,75.5 14.99,78.8 4.32,78.8 4.32,83.58 5.79,83.58 5.79,84.85 9.94,84.85 U4.1
  Bottom 0.152: J3.9 19,22.87 19,64.02 v19.51,64.02
PA5  (via drill 0.35)
  Top 0.152: U1.15 17.83,28.74 17.83,25.41 J3.10 | v21.19,63.76 21.19,64.27 21.49,64.27 21.49,76.11 15.6,76.11 15.6,79.41 6.15,79.41 v6.15,81.29 | U4.3 7.52,83.83 7.52,81.54 v7.47,81.54
  Bottom 0.152: J3.10 22.23,25.41 22.23,63.76 v21.19,63.76 | v7.47,81.54 6.15,81.54 v6.15,81.29
PA6  (via drill 0.35)
  Top 0.152: U1.16 18.24,29.24 18.24,27.95 J3.11 | v20.53,63 20.53,63.06 20.48,63.06 20.48,64.58 21.19,64.58 21.19,75.8 15.29,75.8 15.29,79.11 5.39,79.11 5.39,82.81 v5.54,82.81 | v8.69,82.72 8.69,82.83 U4.5
  Bottom 0.152: J3.11 21.69,27.95 21.69,63 v20.53,63 | v5.54,82.81 8.69,82.81 v8.69,82.72
PA7
  Top 0.152: U1.17 18.24,29.74 18.24,30.49 J3.12 22.23,30.49 22.23,76.72 16.21,76.72 16.21,80.02 8.08,80.02 8.08,83.33 U4.4
PA8
  Top 0.152: U1.29 12.64,38.11 7.06,38.11 7.06,35.47 4.88,35.47 4.88,38.41 4.27,38.41 4.27,40.65 J4.16
PA9  (via drill 0.35)
  Top 0.152: J4.15 4.58,38.11 4.58,35.16 7.47,35.16 7.47,37.7 12.14,37.7 U1.30 12.14,33.74 12.24,33.74 12.24,33.03 v12.44,33.03 | J1.3 v17.73,55.89
  Bottom 0.152: v17.73,55.89 18.7,55.89 18.7,35.57 12.44,35.57 v12.44,33.03
PA10  (via drill 0.35)
  Top 0.152: J4.14 4.27,35.57 4.27,34.86 7.78,34.86 7.78,37.4 11.64,37.4 U1.31 11.64,33.03 v11.53,33.03 | J1.2 v17.73,58.43
  Bottom 0.152: v17.73,58.43 17.73,56.91 17.02,56.91 17.02,55.18 18.39,55.18 18.39,35.87 11.53,35.87 v11.53,33.03
PA11
  Top 0.152: U1.32 11.14,37.09 8.08,37.09 8.08,34.55 4.27,34.55 4.27,33.04 3.96,33.04 3.96,33.03 J4.13
PA12  (via drill 0.35)
  Top 0.152: U1.33 10.64,33.03 v10.62,33.03
  Bottom 0.152: v10.62,33.03 10.62,34.05 4.27,34.05 4.27,30.49 J4.12
PA15
  Top 0.152: U1.38 4.27,32.74 4.27,27.95 J4.11
PB0
  Top 0.152: U1.18 17.94,30.24 17.94,30.79 19,30.79 19,33.03 J3.13 21.8,33.03 21.8,76.41 15.9,76.41 15.9,79.71 6.76,79.71 6.76,84.34 U4.2
PB1  (via drill 0.35)
  Top 0.152: J3.14 18.7,35.57 18.7,31.1 17.63,31.1 17.63,30.74 U1.19 10.11,30.74 v10.11,30.24 | v9.35,80.78 9.35,81.88 U4.6
  Bottom 0.152: v10.11,30.24 5.54,30.24 5.54,29.22 1.73,29.22 1.73,79.77 9.35,79.77 v9.35,80.78
PB3
  Top 0.152: U1.39 4.58,32.24 4.58,27.64 4.27,27.64 4.27,25.41 J4.10
PB4
  Top 0.152: J4.9 4.52,22.87 4.52,25.1 4.58,25.1 4.58,27.34 4.88,27.34 4.88,31.74 U1.40
PB5
  Top 0.152: J4.8 4.27,20.33 4.27,22.56 4.88,22.56 4.88,27.04 5.18,27.04 5.18,31.25 7.71,31.25 U1.41
PB6
  Top 0.152: U1.42 5.49,30.74 5.49,26.68 5.18,26.68 5.18,22.26 4.58,22.26 4.58,20.02 4.27,20.02 4.27,17.79 J4.7 1.4,17.79 1.4,62.75 5.29,62.75 | 5.29,62.75 R7.1 | 5.29,62.75 12.14,62.75 U6.2
PB7  (via drill 0.35)
  Top 0.152: U1.43 5.79,30.24 5.79,26.37 5.49,26.37 5.49,21.96 4.88,21.96 4.88,19.72 4.58,19.72 4.58,17.48 4.27,17.48 4.27,15.25 J4.6 1.09,15.25 1.09,63.26 2.75,63.26 R8.1 v4.02,64.24 | v12.75,63 14.18,63 14.18,65.03 U6.4
  Bottom 0.152: v4.02,64.24 4.02,63 v12.75,63
PB8
  Top 0.152: U1.45 6.1,29.24 6.1,26.07 5.79,26.07 5.79,21.65 5.18,21.65 5.18,19.42 4.88,19.42 4.88,17.18 4.58,17.18 4.58,14.94 4.27,14.94 4.27,12.71 J4.5
PB9
  Top 0.152: U1.46 7.71,28.71 6.4,28.71 6.4,25.77 6.1,25.77 6.1,21.35 5.49,21.35 5.49,19.11 5.18,19.11 5.18,16.88 4.88,16.88 4.88,14.49 4.58,14.49 4.58,12.4 4.27,12.4 4.27,10.17 J4.4
PB10  (via drill 0.35)
  Top 0.152: U1.21 18.39,31.74 18.39,38.11 | J3.15 18.39,38.11 | 18.39,38.11 17.73,38.11 v17.73,38.36 | v18.24,74.43 v18.24,74.42 | v18.24,74.42 U2.23 | v18.24,74.42 18.24,68.84 R9.1
  Bottom 0.152: v17.73,38.36 17.73,39.89 16.72,39.89 16.72,39.86 13.36,39.86 13.36,42.12 11.59,42.12 11.59,44.21 17.78,44.21 17.78,54.57 16.41,54.57 16.41,59.5 18.39,59.5 18.39,74.43 v18.24,74.43
PB11  (via drill 0.35)
  Top 0.152: U1.22 16.97,32.24 16.97,32.37 17.42,32.37 17.42,34.75 17.07,34.75 17.07,40.65 18.24,40.65 | J3.16 18.24,40.65 | 18.24,40.65 18.24,41.92 v17.73,41.92 | U2.24 17.53,74.92 17.53,75.14 19.26,75.14 v19.26,73.67 19.26,72.4 19.76,72.4 R10.1
  Bottom 0.152: v17.73,41.92 16.41,41.92 16.41,40.17 13.67,40.17 13.67,42.43 11.89,42.43 11.89,43.9 18.09,43.9 18.09,54.87 16.72,54.87 16.72,59.19 18.7,59.19 18.7,72.4 19.26,72.4 v19.26,73.67
PB12
  Top 0.152: U1.25 14.64,39.43 6.1,39.43 6.1,39.63 5.49,39.63 5.49,41.87 5.18,41.87 5.18,44.1 4.88,44.1 4.88,46.34 4.58,46.34 4.58,48.57 4.27,48.57 4.27,50.81 J4.20
PB13
  Top 0.152: J4.19 4.27,48.27 4.27,46.03 4.58,46.03 4.58,43.8 4.88,43.8 4.88,41.56 5.18,41.56 5.18,39.33 5.79,39.33 5.79,36.38 6.15,36.38 6.15,39.13 14.14,39.13 U1.26
PB14
  Top 0.152: J4.18 4.27,45.73 4.27,43.49 4.58,43.49 4.58,41.26 4.88,41.26 4.88,39.02 5.49,39.02 5.49,36.08 6.45,36.08 6.45,38.72 13.64,38.72 U1.27
PB15
  Top 0.152: U1.28 13.14,38.41 6.76,38.41 6.76,35.77 5.54,35.77 5.18,35.77 5.18,38.72 4.58,38.72 4.58,40.95 4.27,40.95 4.27,43.19 J4.17
PC13  (via drill 0.35)
  Top 0.152: J3.2 19,5.09 19,12.4 18.14,12.4 18.14,16.88 16,16.88 16,24.55 13.67,24.55 v13.67,23.89 | U1.2 9.64,23.89 v9.86,23.89 | v16.72,34.05 16.77,34.05 16.77,47.56 16.75,47.56 R1.1
  Bottom 0.152: v13.67,23.89 v9.86,23.89 | v16.72,34.05 18.7,34.05 18.7,5.09 J3.2
RESET  (via drill 0.35)
  Top 0.152: C22.1 6.56,43.95 | 6.56,43.95 8.64,43.95 S1.1 9.86,45.96 9.86,47.25 12.65,47.25 | R5.1 6.56,43.95 | U1.7 12.14,24.65 v12.65,24.65 | 12.65,47.25 16.46,47.25 16.46,34.81 v15.95,34.81 | v12.65,43.19 12.65,47.25 | J3.17 v17.48,43.19
  Bottom 0.152: v12.65,24.65 18.39,24.65 18.39,32.27 16.01,32.27 16.01,34.81 v15.95,34.81 | v17.48,43.19 v12.65,43.19
SWCLK  (via drill 0.35)
  Top 0.152: U1.37 8.33,33.24 8.33,34.05 8.59,34.05 8.59,36.49 v8.69,36.49
  Bottom 0.152: v8.69,36.49 8.69,40.17 9.91,40.17 9.91,58.43 J2.2
SWDIO  (via drill 0.35)
  Top 0.152: v10.87,55.89 J2.3 | U1.34 10.14,35.82 10.62,35.82 10.62,36.49 v10.53,36.49
  Bottom 0.152: v10.53,36.49 10.53,39.63 12.65,39.63 12.65,41.82 11.28,41.82 11.28,44.51 11.38,44.51 11.38,55.89 v10.87,55.89
VDD  (via drill 0.35)
  Top 0.152: U1.9 13.14,27.95 v13.16,27.95 | U1.48 9.6,27.74 v9.6,27.95 | U1.36 9.14,33.28 9.1,33.28 v9.1,33.03 | U1.24 14.68,33.24 v14.68,33.28 | C28.1 C27.1 10.94,12.91 U5.5 10.94,13.22 v11.89,13.22 | 6.33,47 R5.2 6.56,47.76 | J2.4 5.54,53.35 | 5.54,53.35 C29.1 | U6.1 11.64,64.53 U6.10 11.12,64.63 11.54,64.63 11.54,65.39 12.06,65.39 12.06,65.8 U6.6 12.14,66.81 13.16,66.81 | 13.16,66.81 14.18,66.81 14.18,65.74 C14.1 C15.2 | U2.8 8.08,74.42 8.08,74.94 | C4.1 8.08,74.94 | C5.1 10.64,69.86 | U2.13 10.64,69.86 | U4.18 11.89,86.93 6.05,86.93 6.05,87.89 v4.78,87.89 | U4.15 13.84,85.92 14.12,85.92 14.12,86.88 14.95,86.88 v14.95,87.12 | 8.08,74.94 v8.08,76.72 | 10.64,69.86 10.64,68.84 v10.87,68.84 13.16,68.84 | 13.16,66.81 13.16,68.84 | v7.06,65.83 R7.2 R8.2 | R10.2 19.76,66.81 v20.02,66.81 | U4.7 11.39,80.78 v10.62,80.78 | J3.18 19,45.73 19,53.35 | 19,53.35 J1.4 | 19,53.35 13.16,53.35 v13.16,52.08 13.16,47.76 8.88,47.76 | R6.1 8.88,47.76 | 8.88,47.76 6.56,47.76 | 6.56,47.76 5.54,47.76 5.54,53.35 | 13.16,68.84 R9.2
  Bottom 0.152: v9.1,33.03 9.41,33.03 C21.1 | C19.1 14.68,31.51 v14.68,33.28 | v13.16,27.95 14.37,27.95 C20.1 | v9.6,27.95 9.6,29.22 C18.1
  pour Bottom: -4.62,93.99 25.86,93.99 25.86,0.01 -4.62,0.01
VDD_PA  (via drill 0.35)
  Top 0.152: U4.11 15.7,82.83 v15.7,82.81 | v14.43,87.89 C12.2 | L1.2 v20.53,90.94 20.53,92.21 21.8,92.21 C11.2
  Bottom 0.152: v15.7,82.81 15.7,87.89 | v14.43,87.89 15.7,87.89 | 15.7,87.89 20.78,87.89 20.78,90.94 v20.53,90.94

### Text on the board
tValues: GND | GND | SWCLK | RX | SWDIO | TX | VDD | VDD | PB12 | GND | PB13 | GND | PB14 | VDD | PB15 | RST | PA8 | PB11 | PA9 | PB10 | PA10 | PB1 | PA11 | PB0 | PA12 | PA7 | PA15 | PA6 | PB3 | PA5 | PB4 | PA4 | PB5 | PA3 | PB6 | PA2 | PB7 | PA1 | PB8 | PA0 | PB9 | PC15 | 5V | PC14 | GND | PC13 | VDD
201bmp: C:/Users/cbaro/OneDrive/Pictures/picodrone.bmp